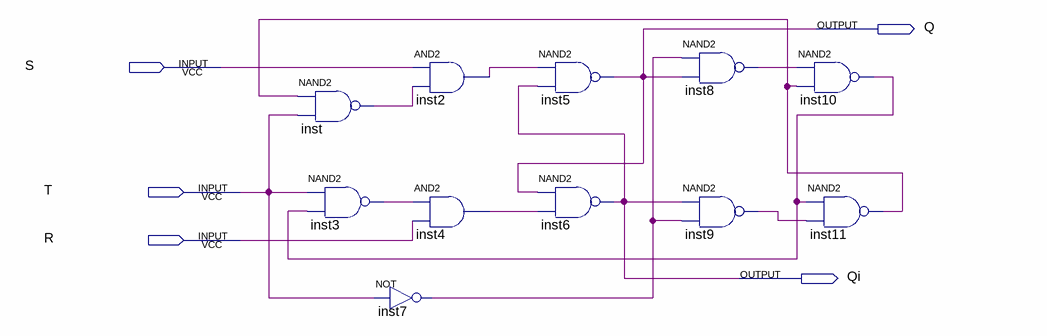
[diagram p0: schematic sheet]
// Quartus schematic p2_trs.bdf as structural Verilog: 11 symbols, 5 pins
module p2_trs (
  input  S,
  input  T,
  input  R,
  output Q,
  output Qi
);

  wire inst2_out, inst3_out, inst4_out, inst7_out, inst8_out, inst9_out, inst10_out, inst11_out, inst_out;

  nand inst (inst_out, inst11_out, T);
  nand inst3 (inst3_out, T, inst10_out);
  not inst7 (inst7_out, T);
  and inst2 (inst2_out, S, inst_out);
  and inst4 (inst4_out, inst3_out, R);
  nand inst5 (Q, inst2_out, Qi);
  nand inst6 (Qi, Q, inst4_out);
  nand inst8 (inst8_out, inst7_out, Q);
  nand inst9 (inst9_out, Qi, inst7_out);
  nand inst10 (inst10_out, inst8_out, inst11_out);
  nand inst11 (inst11_out, inst10_out, inst9_out);
endmodule
